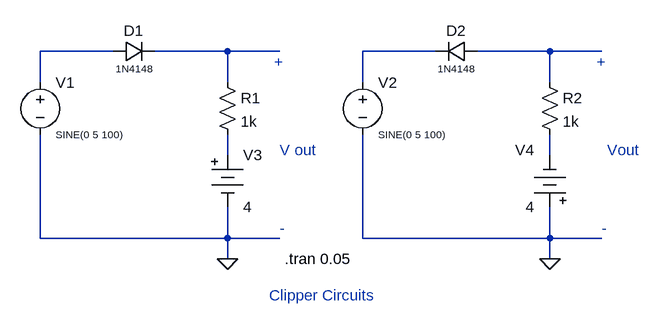
[diagram p0: schematic Clipper_Circuits.asc]
Clipper_Circuits.asc, the LTspice schematic file:
Version 4
SHEET 1 992 680
WIRE 176 256 64 256
WIRE 352 256 240 256
WIRE 432 256 352 256
WIRE 672 256 560 256
WIRE 848 256 736 256
WIRE 928 256 848 256
WIRE 64 304 64 256
WIRE 352 304 352 256
WIRE 560 304 560 256
WIRE 848 304 848 256
WIRE 352 416 352 384
WIRE 848 416 848 384
WIRE 64 544 64 384
WIRE 352 544 352 496
WIRE 352 544 64 544
WIRE 432 544 352 544
WIRE 560 544 560 384
WIRE 848 544 848 496
WIRE 848 544 560 544
WIRE 928 544 848 544
WIRE 352 576 352 544
WIRE 848 576 848 544
FLAG 848 576 0
FLAG 352 576 0
SYMBOL diode 176 272 R270
WINDOW 0 32 32 VTop 2
WINDOW 3 0 32 VBottom 1
SYMATTR InstName D1
SYMATTR Value 1N4148
SYMBOL diode 736 240 R90
WINDOW 0 0 32 VBottom 2
WINDOW 3 32 32 VTop 1
SYMATTR InstName D2
SYMATTR Value 1N4148
SYMBOL Voltage 64 288 R0
WINDOW 3 24 96 Left 1
SYMATTR Value SINE(0 5 100)
SYMATTR InstName V1
SYMBOL Voltage 560 288 R0
WINDOW 3 24 96 Left 1
SYMATTR Value SINE(0 5 100)
SYMATTR InstName V2
SYMBOL Res 336 288 R0
SYMATTR InstName R1
SYMATTR Value 1k
SYMBOL Res 832 288 R0
SYMATTR InstName R2
SYMATTR Value 1k
SYMBOL Misc/battery 352 400 R0
SYMATTR InstName V3
SYMATTR Value 4
SYMBOL Misc/battery 848 512 R180
WINDOW 0 24 104 Left 2
WINDOW 3 24 16 Left 2
SYMATTR InstName V4
SYMATTR Value 4
TEXT 440 576 Left 2 !.tran 0.05
TEXT 424 272 Left 2 ;+
TEXT 920 272 Left 2 ;+
TEXT 432 528 Left 2 ;-
TEXT 928 528 Left 2 ;-
TEXT 432 408 Left 2 ;V out
TEXT 936 408 Left 2 ;Vout
TEXT 416 632 Left 2 ;Clipper Circuits

The netlist it stands for:
* Clipper_Circuits.asc
D1 N001 N002 1N4148
D2 N004 N003 1N4148
V1 N001 0 SINE(0 5 100)
V2 N003 0 SINE(0 5 100)
R1 N002 N005 1k
R2 N004 N006 1k
V3 N005 0 4
V4 0 N006 4
.model D D
.lib standard.dio
.tran 0.05
* +
* +
* -
* -
* V out
* Vout
* Clipper Circuits
.backanno
.end